# EAGLE schematic front_compact_mil (EAGLE 4.11)

## Sheet 1 of 2
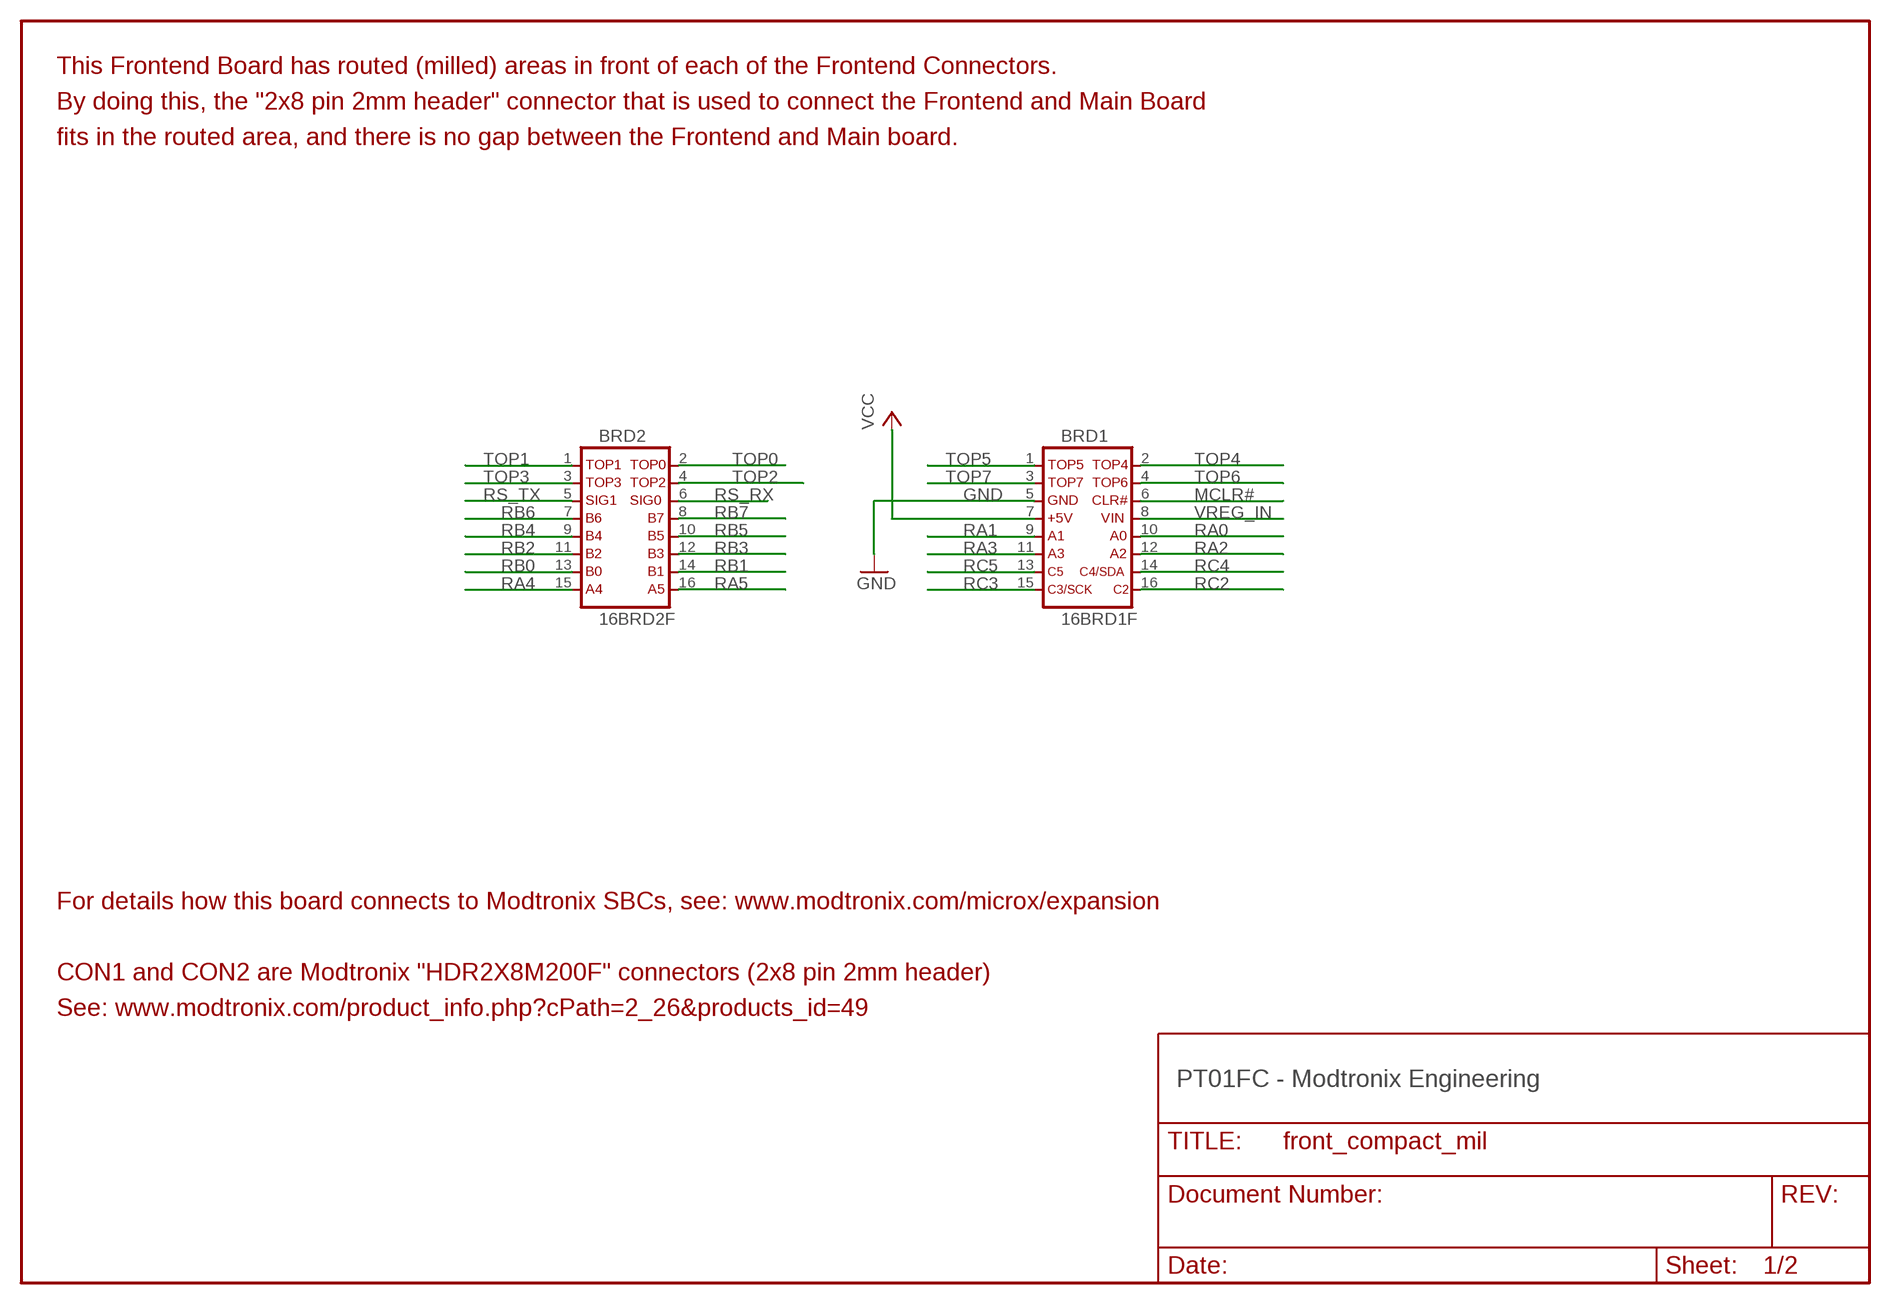
[diagram p0: schematic, sheet 1]

### Parts
BRD1  16BRD1F  [16BRD_FRONT]
BRD2  16BRD2F  [16BRD_FRONTR]

### Nets
GND [power]: BRD1.5
MCLR#: BRD1.6
RA0: BRD1.10
RA1: BRD1.9
RA2: BRD1.12
RA3: BRD1.11
RA4: BRD2.15
RA5: BRD2.16
RB0: BRD2.13
RB1: BRD2.14
RB2: BRD2.11
RB3: BRD2.12
RB4: BRD2.9
RB5: BRD2.10
RB6: BRD2.7
RB7: BRD2.8
RC2: BRD1.16
RC3: BRD1.15
RC4: BRD1.14
RC5: BRD1.13
RS_RX: BRD2.6
RS_TX: BRD2.5
TOP0: BRD2.2
TOP1: BRD2.1
TOP2: BRD2.4
TOP3: BRD2.3
TOP4: BRD1.2
TOP5: BRD1.1
TOP6: BRD1.4
TOP7: BRD1.3
VCC [power]: BRD1.7
VREG_IN [power]: BRD1.8

### Notes on the sheet
- This Frontend Board has routed (milled) areas in front of each of the Frontend Connectors.
- By doing this, the "2x8 pin 2mm header" connector that is used to connect the Frontend and Main Board
- fits in the routed area, and there is no gap between the Frontend and Main board.
- For details how this board connects to Modtronix SBCs, see: www.modtronix.com/microx/expansion
- CON1 and CON2 are Modtronix "HDR2X8M200F" connectors (2x8 pin 2mm header)
- See: www.modtronix.com/product_info.php?cPath=2_26&products_id=49
- PT01FC - Modtronix Engineering

## Sheet 2 of 2

## Library data of the parts
BRD1 = david:16BRD1
BRD2 = david:16BRD2

## Net classes
0 default: width 0.356 mm, drill 0.254 mm, clearance 0.711 mm
1 power: width 0.711 mm, drill 0.254 mm, clearance 0.711 mm
2 output: width 0.711 mm, drill 0.254 mm, clearance 0.711 mm